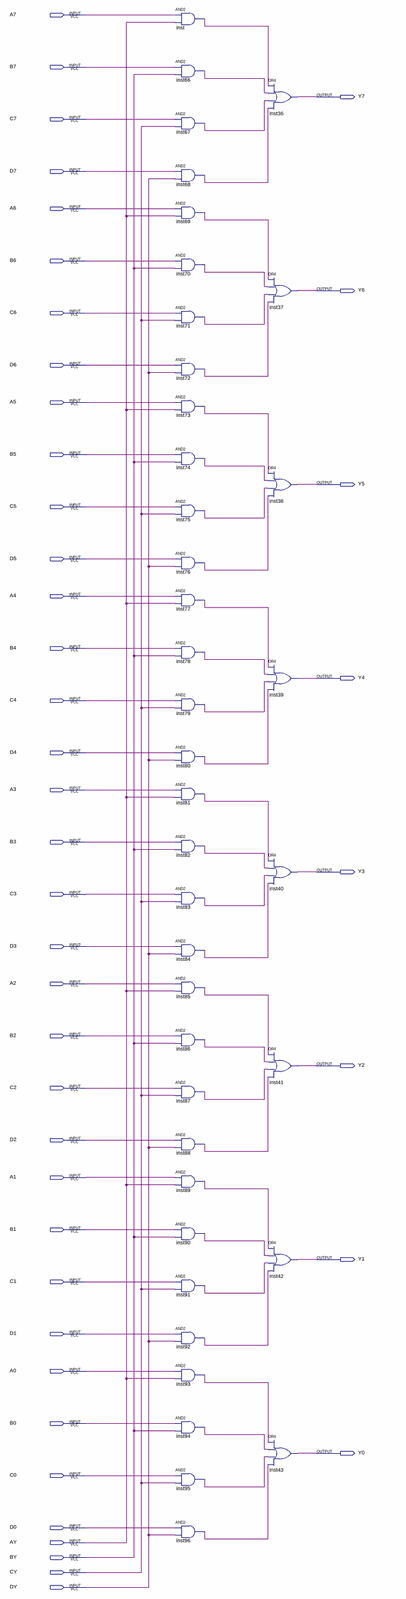
[diagram p0: schematic sheet, whole]
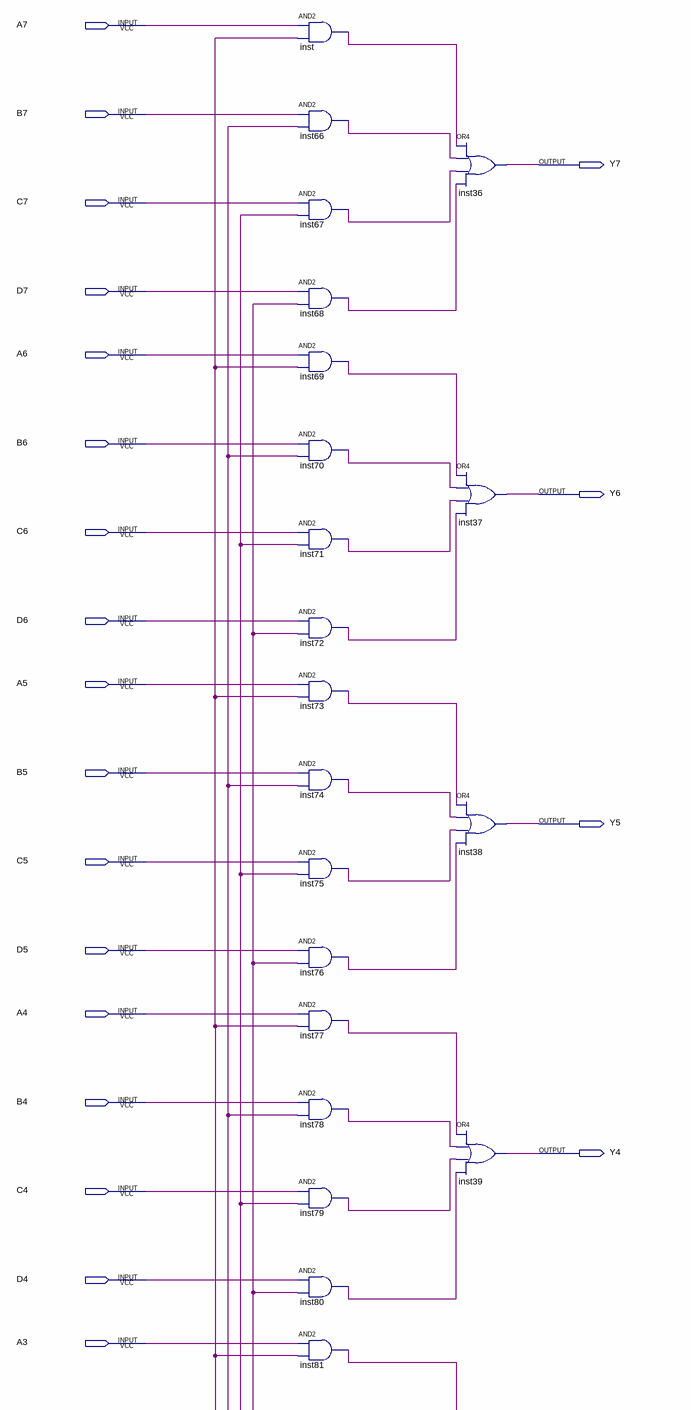
[diagram p1: schematic sheet, upper part]
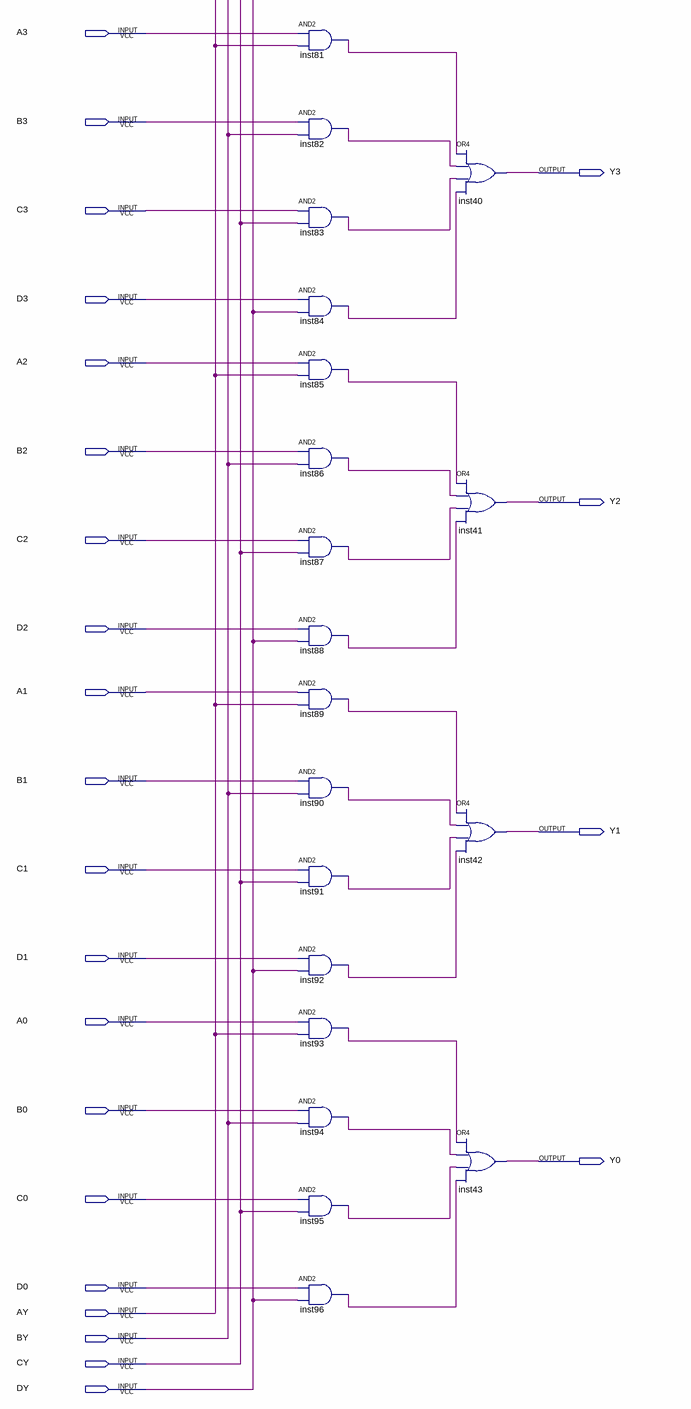
[diagram p2: schematic sheet, lower part]
// Quartus schematic selector-4.bdf as structural Verilog: 40 symbols, 44 pins
module \selector-4  (
  input  A7,
  input  B7,
  input  C7,
  input  D7,
  input  A6,
  input  B6,
  input  C6,
  input  D6,
  input  A5,
  input  B5,
  input  C5,
  input  D5,
  input  A4,
  input  B4,
  input  C4,
  input  D4,
  input  A3,
  input  B3,
  input  C3,
  input  D3,
  input  A2,
  input  B2,
  input  C2,
  input  D2,
  input  A1,
  input  B1,
  input  C1,
  input  D1,
  input  A0,
  input  B0,
  input  C0,
  input  D0,
  input  AY,
  input  BY,
  input  CY,
  input  DY,
  output Y7,
  output Y6,
  output Y5,
  output Y4,
  output Y3,
  output Y2,
  output Y1,
  output Y0
);

  wire inst66_out, inst67_out, inst68_out, inst69_out, inst70_out, inst71_out, inst72_out, inst73_out,
       inst74_out, inst75_out, inst76_out, inst77_out, inst78_out, inst79_out, inst80_out, inst81_out,
       inst82_out, inst83_out, inst84_out, inst85_out, inst86_out, inst87_out, inst88_out, inst89_out,
       inst90_out, inst91_out, inst92_out, inst93_out, inst94_out, inst95_out, inst96_out, inst_out;

  and inst (inst_out, A7, AY);
  and inst66 (inst66_out, B7, BY);
  and inst67 (inst67_out, C7, CY);
  and inst68 (inst68_out, D7, DY);
  and inst69 (inst69_out, A6, AY);
  and inst70 (inst70_out, B6, BY);
  and inst71 (inst71_out, C6, CY);
  and inst72 (inst72_out, D6, DY);
  and inst73 (inst73_out, A5, AY);
  and inst74 (inst74_out, B5, BY);
  and inst75 (inst75_out, C5, CY);
  and inst76 (inst76_out, D5, DY);
  and inst77 (inst77_out, A4, AY);
  and inst78 (inst78_out, B4, BY);
  and inst79 (inst79_out, C4, CY);
  and inst80 (inst80_out, D4, DY);
  and inst81 (inst81_out, A3, AY);
  and inst82 (inst82_out, B3, BY);
  and inst83 (inst83_out, C3, CY);
  and inst84 (inst84_out, D3, DY);
  and inst85 (inst85_out, A2, AY);
  and inst86 (inst86_out, B2, BY);
  and inst87 (inst87_out, C2, CY);
  and inst88 (inst88_out, D2, DY);
  and inst89 (inst89_out, A1, AY);
  and inst90 (inst90_out, B1, BY);
  and inst91 (inst91_out, C1, CY);
  and inst92 (inst92_out, D1, DY);
  and inst93 (inst93_out, A0, AY);
  and inst94 (inst94_out, B0, BY);
  and inst95 (inst95_out, C0, CY);
  and inst96 (inst96_out, D0, DY);
  or inst36 (Y7, inst_out, inst66_out, inst67_out, inst68_out);
  or inst37 (Y6, inst69_out, inst70_out, inst71_out, inst72_out);
  or inst38 (Y5, inst73_out, inst74_out, inst75_out, inst76_out);
  or inst39 (Y4, inst77_out, inst78_out, inst79_out, inst80_out);
  or inst40 (Y3, inst81_out, inst82_out, inst83_out, inst84_out);
  or inst41 (Y2, inst85_out, inst86_out, inst87_out, inst88_out);
  or inst42 (Y1, inst89_out, inst90_out, inst91_out, inst92_out);
  or inst43 (Y0, inst93_out, inst94_out, inst95_out, inst96_out);
endmodule
